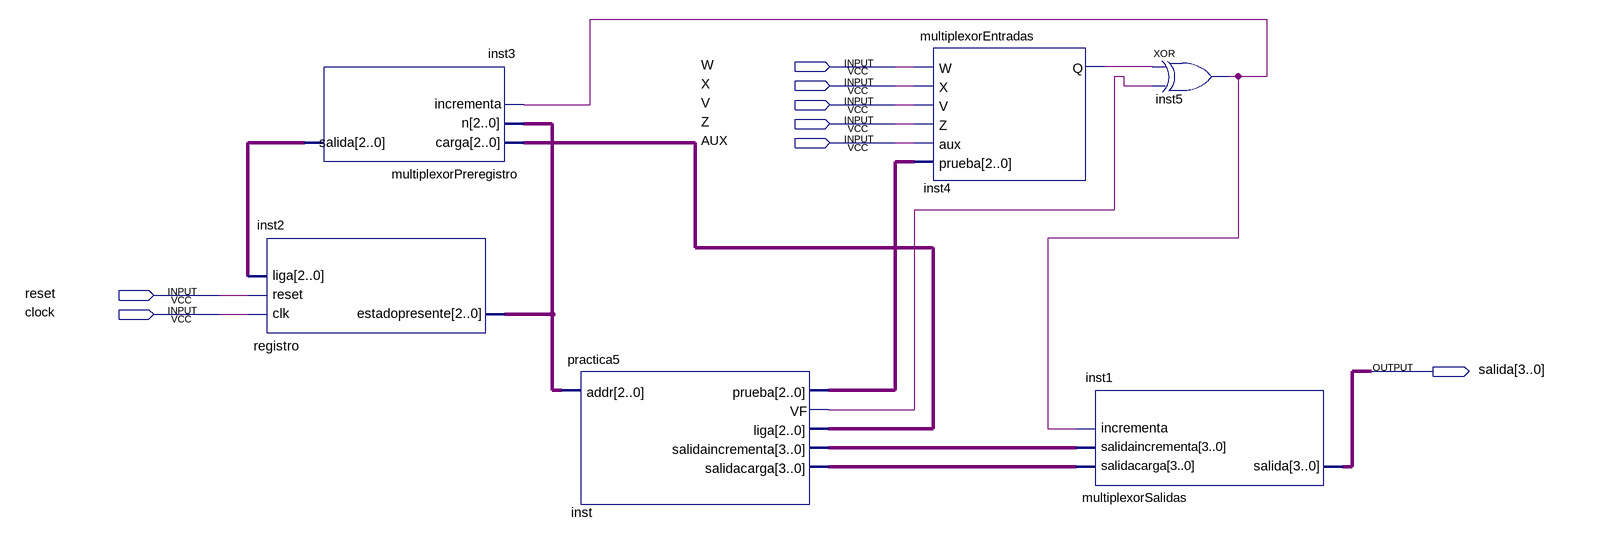
[diagram p0: schematic sheet]
// Quartus schematic Block1.bdf as structural Verilog: 6 symbols, 8 pins
module Block1 (
  input  W,
  input  X,
  input  V,
  input  Z,
  input  AUX,
  input  reset,
  input  clock,
  output [3:0] salida
);

  wire inst4_q, inst5_out, inst_vf;
  wire [2:0] inst2_estadopresente, inst3_salida, inst_liga, inst_prueba;
  wire [3:0] inst_salidacarga, inst_salidaincrementa;

  registro inst2 (.clk(clock), .reset(reset), .liga(inst3_salida), .estadopresente(inst2_estadopresente));
  multiplexorPreregistro inst3 (
    .carga(inst_liga), .n(inst2_estadopresente), .incrementa(inst5_out), .salida(inst3_salida));
  practica5 inst (
    .addr(inst2_estadopresente), .prueba(inst_prueba), .VF(inst_vf), .liga(inst_liga),
    .salidaincrementa(inst_salidaincrementa), .salidacarga(inst_salidacarga));
  multiplexorEntradas inst4 (.W(W), .X(X), .V(V), .Z(Z), .aux(AUX), .prueba(inst_prueba), .Q(inst4_q));
  multiplexorSalidas inst1 (
    .salidacarga(inst_salidacarga), .salidaincrementa(inst_salidaincrementa), .incrementa(inst5_out),
    .salida(salida));
  xor inst5 (inst5_out, inst4_q, inst_vf);
endmodule
